# Altium schematic sheet Main_Board.SchDoc
size A3; SheetNumber: 1; SheetTotal: 5
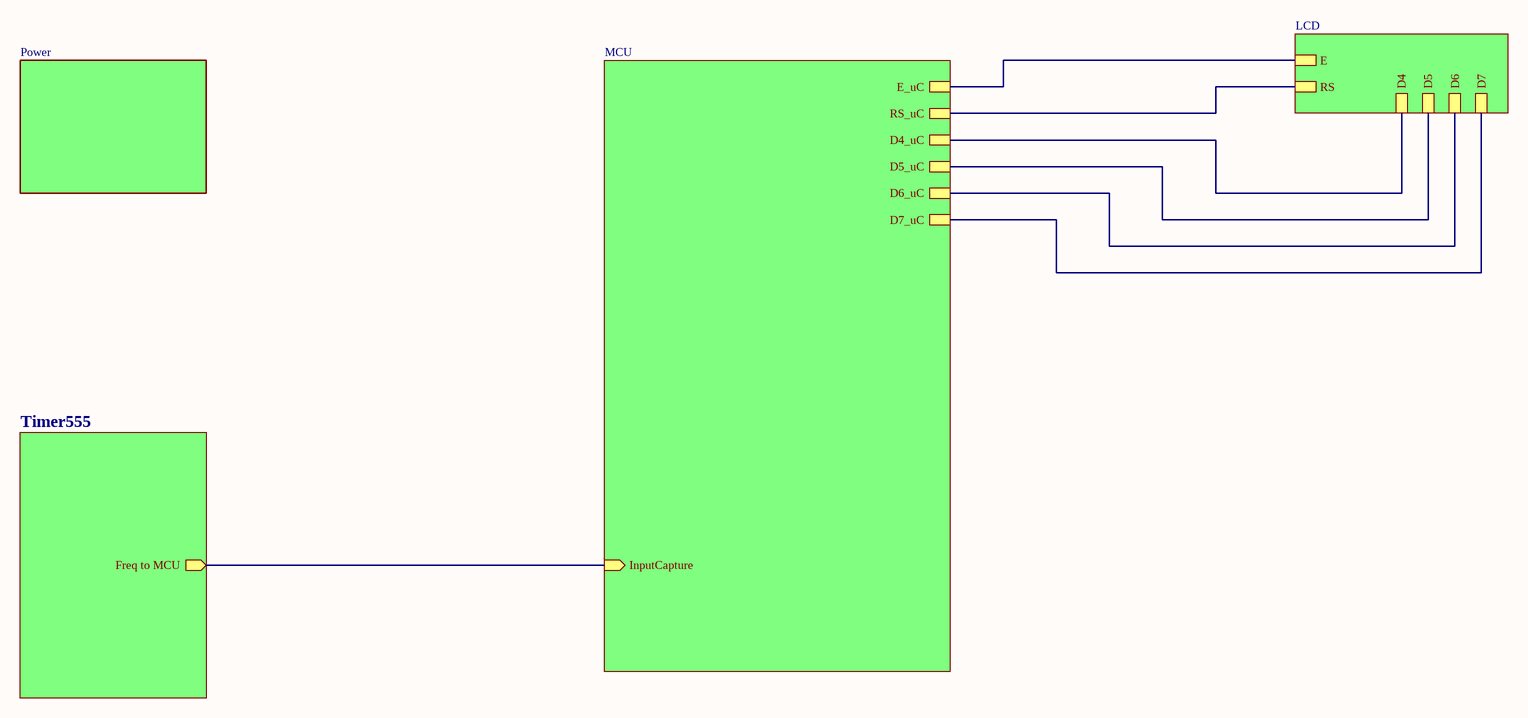
[diagram p0: Main_Board.SchDoc]

## Sub-sheets
LCD_D = LCD: E, RS, D4, D5, D6, D7
MCU_D = MCU: E_uC, RS_uC, D4_uC, D5_uC, D6_uC, D7_uC, InputCapture (in)
Power_D = Power: no entries
Timer555_D = Timer555: Freq to MCU (out)

## Nets
(unnamed): sheet Timer555_D/Freq to MCU, sheet MCU_D/InputCapture
(unnamed): sheet MCU_D/E_uC, sheet LCD_D/E
(unnamed): sheet MCU_D/RS_uC, sheet LCD_D/RS
(unnamed): sheet MCU_D/D4_uC, sheet LCD_D/D4
(unnamed): sheet MCU_D/D5_uC, sheet LCD_D/D5
(unnamed): sheet MCU_D/D6_uC, sheet LCD_D/D6
(unnamed): sheet MCU_D/D7_uC, sheet LCD_D/D7